# EAGLE design defmon (EAGLE 6.6.0)
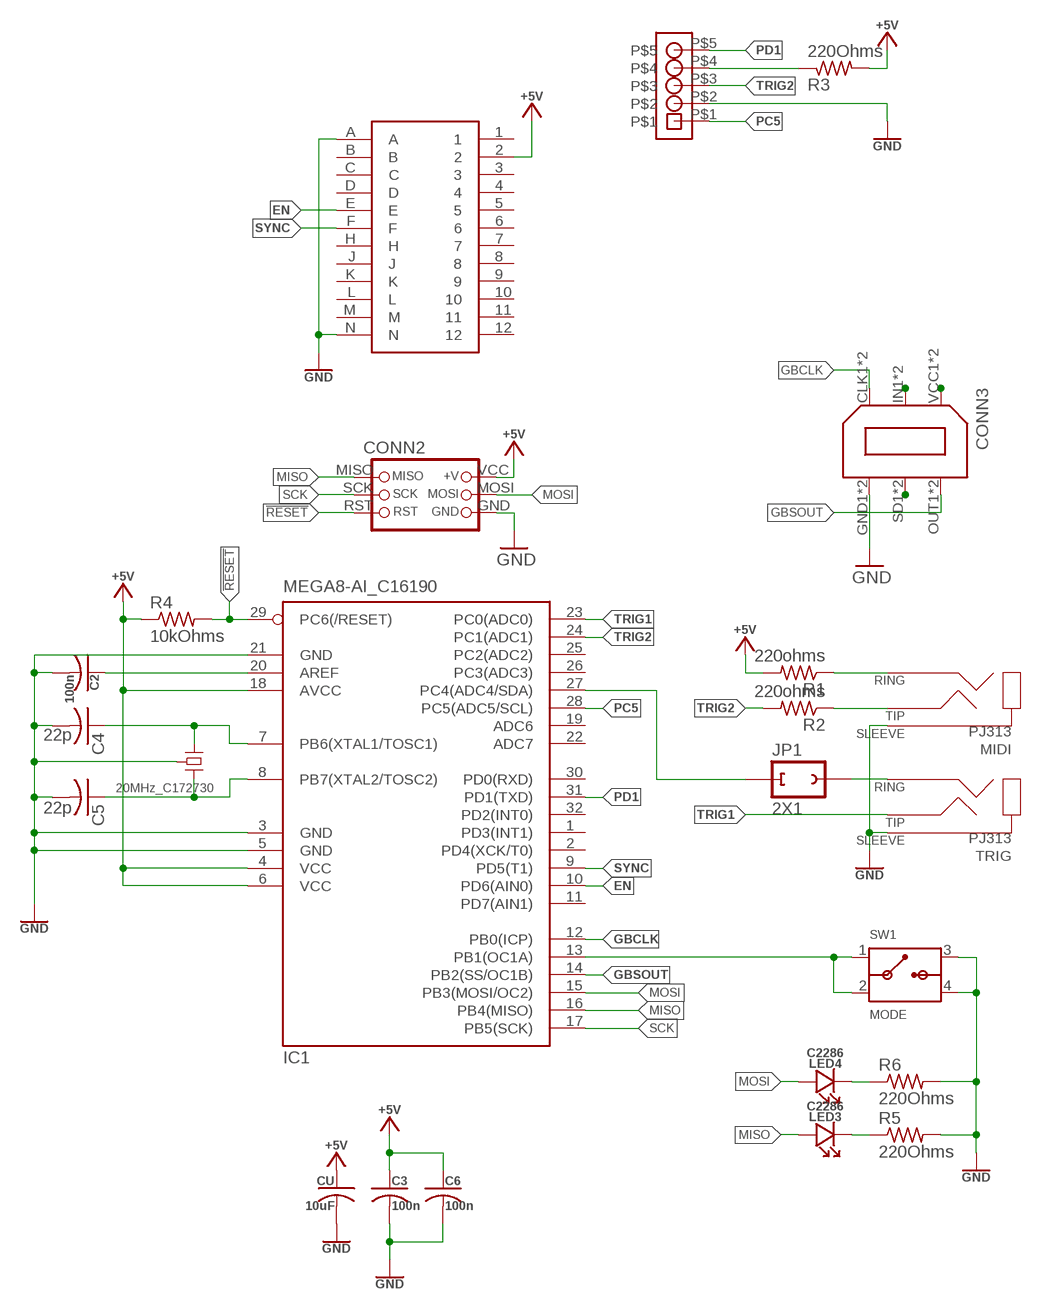
[diagram p0: schematic, sheet 1]

## Parts
C2  100n  C-USC0603K  [C0603K]
C3  100n  C-USC0603K  [C0603K]
C4  22p  C-USC0603K  [C0603K]
C5  22p  C-USC0603K  [C0603K]
C6  100n  C-USC0603K  [C0603K]
CONN2  DNP  ICSP  [ICSP_SMD_PROBE]
CONN3  LINK_PORTFINAL  [DUAL_BAORD_LINK_FINAL]
CU  10uF  C-USC0603K  [C0603K]
DIN  1X5  [1X5]
IC1  MEGA8-AI_C16190  MEGA8-AI  [TQFP32-08]
JP1  2X1  [2X1]
LED3  C2286  0603LED  [0603K]
LED4  C2286  0603LED  [0603K]
MIDI  PJ313  [PJ313D]
Q1  20MHz_C172730  CRYSTAL  [SX3225]
R1  220ohms  R-US_R0603  [R0603]
R2  220ohms  R-US_R0603  [R0603]
R3  220Ohms  R-US_R0603  [R0603]
R4  10kOhms  R-US_R0603  [R0603]
R5  220Ohms  R-US_R0603  [R0603]
R6  220Ohms  R-US_R0603  [R0603]
SW1  MODE  TACTILETS5215A  [TS5215A]
TRIG  PJ313  [PJ313D]
U$2  CONNECTOR_C64UJ  [C64_USERPORT]

## Nets
!RESET: CONN2.RST IC1.29(PC6(/RESET)) R4.2
+5V: C3.1 C6.1 CONN2.VCC(+V) CU.1 IC1.4(VCC) IC1.6(VCC) IC1.18(AVCC) R1.2 R3.2 R4.1 U$2.2
AREF: C2.1 IC1.20(AREF)
EN: IC1.10(PD6(AIN0)) U$2.E
GBCLK: CONN3.CLK1(CLK) CONN3.CLK2(CLK) IC1.12(PB0(ICP))
GBSOUT: CONN3.OUT1(OUT) CONN3.OUT2(OUT) IC1.14(PB2(SS/OC1B))
GND: C2.2 C3.2 C4.2 C5.2 C6.2 CONN2.GND CONN3.GND1(GND) CONN3.GND2(GND) CU.2 DIN.P$2 IC1.3(GND) IC1.5(GND) IC1.21(GND) MIDI.2 MIDI.22 Q1.2(GND) Q1.4(GND) R5.2 R6.2 SW1.3(B1) SW1.4(B2) TRIG.2 TRIG.22 U$2.A U$2.N
MISO: CONN2.MISO IC1.16(PB4(MISO)) LED3.A
MOSI: CONN2.MOSI IC1.15(PB3(MOSI/OC2)) LED4.A
N$1: CONN3.VCC1(+5V) CONN3.VCC2(+5V)
N$2: CONN3.SD1(SD) CONN3.SD2(SD)
N$3: DIN.P$4 R3.1
N$4: LED3.C R5.1
N$5: CONN3.IN1(IN) CONN3.IN2(IN)
N$6: MIDI.4 MIDI.44 R2.1
N$7: LED4.C R6.1
N$8: C4.1 IC1.7(PB6(XTAL1/TOSC1)) Q1.3(X1)
N$9: JP1.P$2 TRIG.3
N$10: IC1.27(PC4(ADC4/SDA)) JP1.P$1
N$11: C5.1 IC1.8(PB7(XTAL2/TOSC2)) Q1.1(X2)
N$12: MIDI.3 R1.1
N$20: IC1.13(PB1(OC1A)) SW1.1(A1) SW1.2(A2)
PC5: DIN.P$1 IC1.28(PC5(ADC5/SCL))
PD1: DIN.P$5 IC1.31(PD1(TXD))
SCK: CONN2.SCK IC1.17(PB5(SCK))
SYNC: IC1.9(PD5(T1)) U$2.F
TRIG1: IC1.23(PC0(ADC0)) TRIG.4 TRIG.44
TRIG2: DIN.P$3 IC1.24(PC1(ADC1)) R2.2
Unconnected: IC1.1(PD3(INT1)) IC1.2(PD4(XCK/T0)) IC1.11(PD7(AIN1)) IC1.19(ADC6) IC1.22(ADC7) IC1.25(PC2(ADC2)) IC1.26(PC3(ADC3)) IC1.30(PD0(RXD)) IC1.32(PD2(INT0)) U$2.1 U$2.3 U$2.4 U$2.5 U$2.6 U$2.7 U$2.8 U$2.9 U$2.10 U$2.11 U$2.12 U$2.B U$2.C U$2.D U$2.H U$2.J U$2.K U$2.L U$2.M

## Library data of the parts
C2-C6 CU = rcl:C-US: CAPACITOR, American symbol
CONN2 = GenMDMv2:ICSP
CONN3 = LinkPort by Jazz:LINK_PORT
DIN = header by Jazz:1X5
IC1 = atmel:MEGA8: MICROCONTROLLER 8 Kbytes FLASH, 1 kbytes SRAM, 512 bytes EEPROM, USART, 6-channel 10 bit ADC, 2-channel 8 bit ADC Pin compatible with Atmega48, ATMega88, ATMega168 Source: avr.lbr; MPN: ATMEGA8-16AU; OC_FARNELL: 9171371; OC_NEWARK: 73M8863
JP1 = header by Jazz:2X1
LED3 LED4 = Led by Jazz:0603LED
MIDI TRIG = GenMDMv200:PJ313
Q1 = GenMDMv200:CRYSTAL: (16MHz) LCSC: C13738
R1-R6 = rcl:R-US_: RESISTOR, American symbol
SW1 = Switch by Jazz:TACTILE
U$2 = defmon:CONNECTOR_C64U

## Board
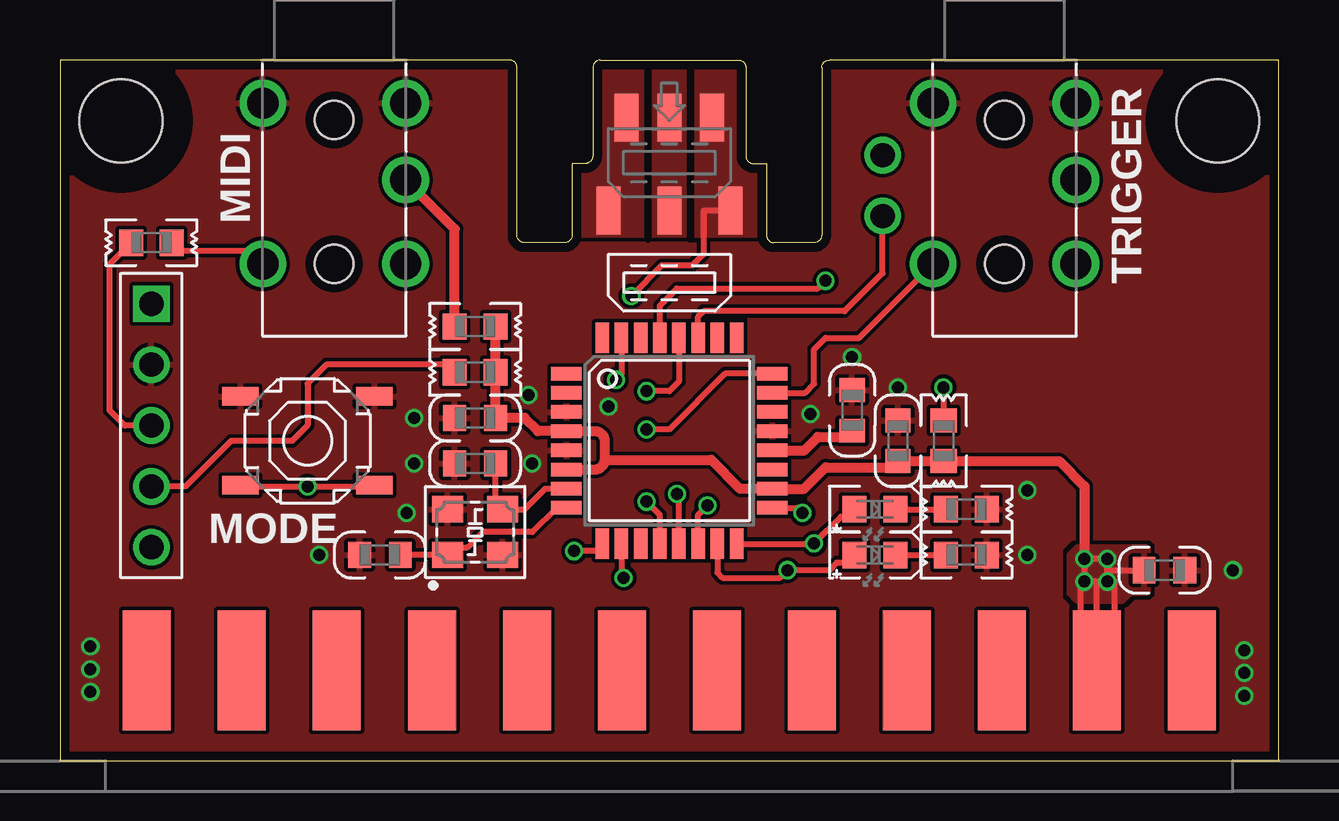
[diagram p1: board, top side]
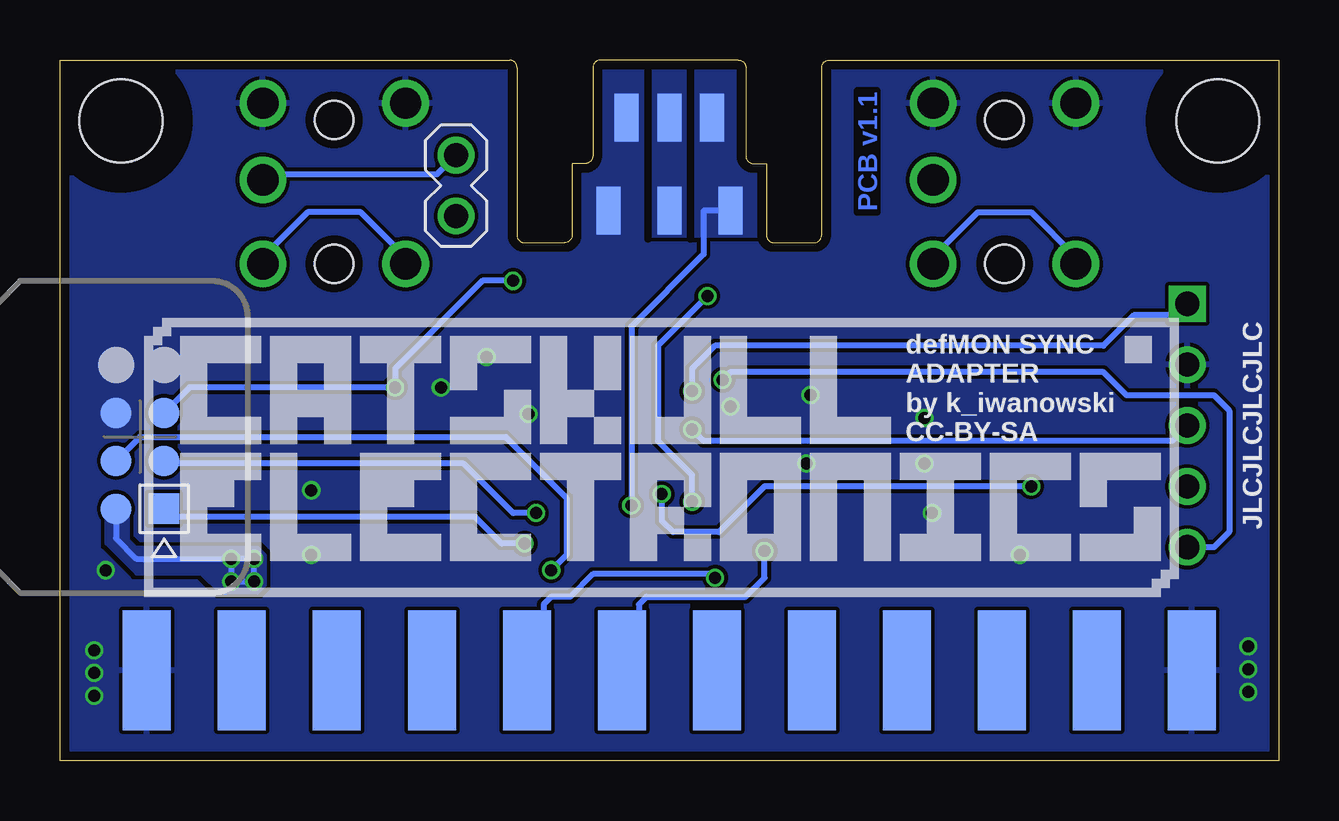
[diagram p2: board, bottom side, seen from below]

Size 50.8 x 29.21 mm. Coordinates in mm from the lower left corner, seen from the top.
Outline: 29.77,21.59 31.43,21.59 arc90 31.75,21.91 31.75,28.89 arc-90 32.07,29.21 50.8,29.21 50.8,0 0,0 0,29.21 18.73,29.21 arc-90 19.05,28.89 19.05,21.91 arc90 19.37,21.59 21.03,21.59
Copper layers (1*16): Top 0.035mm / dielectric 1.5mm / Bottom 0.035mm
Design rules "PCBWAY": minimum track width 4mil, minimum drill 0.2mm, track to track 6mil, track to pad 6mil, pad to pad 6mil, via to via 6mil, smd to smd 6mil, copper to edge 15mil, drill to drill 6mil, minimum pad ring 6mil, minimum via ring 5mil, stop-mask expansion 4mil, vias tented up to drill 37mil, thermal gap 6mil

### Footprints (pad centres in the part's own frame; a part is rotated, then mirrored left to right if it is on the bottom)
C0603K = smd 1 x 1.1: 1 -0.85,0; 2 0.85,0
ICSP_SMD_PROBE = smd 1.27 x 1.27: GND 1,-1; MISO -1,3; MOSI 1,1; RST -1,-1; SCK -1,1; VCC 1,3
DUAL_BAORD_LINK_FINAL = smd 2 x 1: CLK1 -6.287,-2.54; CLK2 -2.413,-1.778; IN1 -6.287,0; IN2 -2.413,0; VCC1 -6.287,2.54; VCC2 -2.413,1.778 | smd 2 x 1 bottom: GND1 -6.287,-2.54; GND2 -2.413,-1.778; OUT1 -6.287,2.54; OUT2 -2.413,1.778; SD1 -6.287,0; SD2 -2.413,0
1X5 = drill 1.016 square: P$1 -5.08,0 | drill 1.016: P$2 -2.54,0; P$3 0,0; P$4 2.54,0; P$5 5.08,0
TQFP32-08 = smd 1.27 x 0.559: 1 -4.293,2.8; 2 -4.293,2; 3 -4.293,1.2; 4 -4.293,0.4; 5 -4.293,-0.4; 6 -4.293,-1.2; 7 -4.293,-2; 8 -4.293,-2.8; 17 4.293,-2.8; 18 4.293,-2; 19 4.293,-1.2; 20 4.293,-0.4; 21 4.293,0.4; 22 4.293,1.2; 23 4.293,2; 24 4.293,2.8 | smd 0.559 x 1.27: 9 -2.8,-4.293; 10 -2,-4.293; 11 -1.2,-4.293; 12 -0.4,-4.293; 13 0.4,-4.293; 14 1.2,-4.293; 15 2,-4.293; 16 2.8,-4.293; 25 2.8,4.293; 26 2,4.293; 27 1.2,4.293; 28 0.4,4.293; 29 -0.4,4.293; 30 -1.2,4.293; 31 -2,4.293; 32 -2.8,4.293
2X1 = drill 1.016: P$1 -1.27,0; P$2 1.27,0
0603K = smd 1 x 1.1: A 0.85,0; C -0.85,0
PJ313D = drill 1.3: 2 -2.975,-1.8; 3 2.975,-5; 4 -2.975,-8.5; 22 2.975,-1.8; 44 2.975,-8.5 | hole 1.6: 0,-2.5; 0,-8.5
SX3225 = smd 1.3 x 1.1: 1 -1.15,-0.95; 2 1.15,-0.95; 3 1.15,0.95; 4 -1.15,0.95
R0603 = smd 1 x 1.1: 1 -0.85,0; 2 0.85,0
TS5215A = smd 1.524 x 0.762: 1 -2.794,1.85; 2 2.794,1.85; 3 -2.794,-1.85; 4 2.794,-1.85
C64_USERPORT = smd 2 x 5: 1 21.78,5.04; 2 17.82,5.04; 3 13.86,5.04; 4 9.9,5.04; 5 5.94,5.04; 6 1.98,5.04; 7 -1.98,5.04; 8 -5.94,5.04; 9 -9.9,5.04; 10 -13.86,5.04; 11 -17.82,5.04; 12 -21.78,5.04 | smd 2 x 5 bottom: A 21.78,5.04; B 17.82,5.04; C 13.86,5.04; D 9.9,5.04; E 5.94,5.04; F 1.98,5.04; H -1.98,5.04; J -5.94,5.04; K -9.9,5.04; L -13.86,5.04; M -17.82,5.04; N -21.78,5.04
MOUNT4-40 = hole 3.45: 0,0

### Placement (x,y rotation side)
C2  33.02,14.61 90 top
C3  34.92,13.34 90 top
C4  17.3,12.38 180 top
C5  13.33,8.57 180 top
C6  17.3,14.29 180 top
CONN2  47.47,13.49 180 bottom
CONN3  25.4,29.21 90 top
CU  46.04,7.94 0 top
DIN  3.81,13.97 270 top
IC1  25.4,13.34 0 top
JP1  34.29,23.97 90 bottom
LED3  33.97,10.48 180 top
LED4  33.97,8.57 180 top
MIDI  11.43,29.21 0 top
Q1  17.3,9.53 0 top
R1  17.3,18.1 0 top
R2  3.81,21.59 180 top
R3  17.3,16.19 0 top
R4  36.83,13.34 90 top
R5  37.78,10.48 0 top
R6  37.78,8.57 0 top
SW1  10.32,13.34 180 top
TRIG  39.37,29.21 0 top
U$1  [JLCJLCJLCJLC]  1.11,13.97 270 bottom
U$2  25.4,-1.27 0 top
U$3  [MOUNT4-40]  2.54,26.67 0 top
U$8  [MOUNT4-40]  48.26,26.67 0 top
U$9  [CATSKULL_PIXEL_MD]  25.72,6.83 0 bottom

### Tracks (layer width: path | path; a pad name or v marks a point on that pad's centre or on a via)
!RESET  (via drill 0.5)
  Top 0.254: IC1.29 25,18.97 25.72,19.68 31.59,19.68 v31.91,20 | v36.83,15.56 R4.2
  Bottom 0.254: CONN2.RST 45.4,15.56 v36.83,15.56 36.83,16.35 33.18,20 v31.91,20
+5V  (via drill 0.5)
  Top 0.254: v43.66,7.46 v43.66,8.41 | v43.66,8.41 v42.7,8.41 v42.7,7.46 | v43.66,8.41 43.66,7.94 CU.1 | 43.18,7.46 v42.7,7.46 | U$2.2 42.55,3.77 42.55,7.46 v42.7,7.46 | U$2.2 43.97,3.77 43.97,7.46 v43.66,7.46 | U$2.2 43.22,7.46 v43.66,7.46
  Top 0.406: v42.7,8.41 42.7,11.43 41.65,12.49 R4.1 C3.1 34.66,12.22 31.91,12.22 31.02,11.34 IC1.18 28.35,11.34 27.15,12.54 22.7,12.54 | 22.7,12.54 22.7,13.34 arc90 22.3,13.74 IC1.4 19.92,13.74 19.37,14.29 C6.1 R3.2 R1.2 | IC1.6 22.29,12.13 arc90 22.7,12.54
  Bottom 0.254: CONN2.VCC 48.47,9.27 47.61,8.41 v43.66,8.41 | v43.66,8.41 v43.66,7.46 v42.7,7.46 v42.7,8.41 v43.66,8.41
  pour Top: 42.39,6.67 44.29,6.67 44.61,6.99 45.24,6.99 45.4,7.14 45.4,8.73 45.24,8.89 42.39,8.89 42.07,8.57 42.07,6.99
  pour Bottom: 42.23,8.57 42.55,8.89 47.62,8.89 47.94,9.21 47.94,10.64 48.1,10.79 48.74,10.79 48.89,10.64 48.89,9.05 47.62,7.78 44.93,7.78 44.13,6.99 42.55,6.99 42.23,7.3
AREF
  Top 0.406: IC1.20 31.03,12.94 31.59,13.49 32.76,13.49 C2.1
EN  (via drill 0.5)
  Top 0.254: IC1.10 23.4,7.71 v23.49,7.62
  Bottom 0.254: U$2.E 30.64,4.51 30.64,6.51 30.32,6.83 29.53,6.83 28.57,7.78 23.65,7.78 v23.49,7.62
GBCLK  (via drill 0.5)
  Top 0.254: IC1.12 25,10.24 v24.45,10.79 | CONN3.CLK1 26.83,22.92 26.83,21.11 26.35,20.64 25.08,20.64 v23.81,19.37
  Bottom 0.254: v24.45,10.79 24.45,11.91 25.88,13.34 25.88,17.3 v23.81,19.37
  pour Top: 29.53,21.91 26.43,21.91 26.43,29.21 29.53,29.21
GBSOUT  (via drill 0.5)
  Top 0.254: IC1.14 26.6,10.25 v26.99,10.64
  Bottom 0.254: CONN3.OUT1 23.97,22.92 23.97,21.11 26.99,18.1 v26.99,10.64
  pour Bottom: 21.27,21.91 24.37,21.91 24.37,29.21 21.27,29.21
GND  (via drill 0.5)
  other vias: 31.27,14.45 40.32,11.27 40.32,8.57 19.68,12.38 19.53,15.24 22.86,14.76 14.76,14.29 10.79,8.57 14.45,10.32 14.76,12.38 34.92,15.56 33.02,16.83 48.89,7.94 49.37,3.65 49.37,4.6 49.37,2.7 1.27,3.81 1.27,4.76 1.27,2.86
  pour Top (rank 3): 0,0 50.8,0 50.8,29.21 0,29.21
  pour Bottom (rank 3): 0,0 50.8,0 50.8,29.21 0,29.21
MISO  (via drill 0.5)
  Top 0.254: IC1.16 31.27,9.04 v31.43,9.05 32.54,10.16 32.8,10.16 LED3.A
  Bottom 0.254: CONN2.MISO 46.13,10.16 33.5,10.16 32.38,9.05 v31.43,9.05
MOSI  (via drill 0.5)
  Top 0.254: IC1.15 27.4,7.84 27.62,7.62 30,7.62 v30.32,7.94 32.07,7.94 32.38,8.26 32.8,8.26 LED4.A
  Bottom 0.254: CONN2.MOSI 47.47,13.49 32.23,13.49 29.69,10.95 29.69,8.57 v30.32,7.94
N$1
  pour Top: 24.37,21.91 24.37,29.21 21.27,29.21 21.27,21.91
N$2
  pour Bottom (rank 2): 26.11,29.21 26.11,21.91 24.69,21.91 24.69,29.21
N$3
  Top 0.254: DIN.P$4 5.24,11.43 7.14,13.34 9.68,13.34 10.32,13.97 10.32,15.72 11.11,16.51 16.14,16.51 R3.1
N$4
  Top 0.254: LED3.C R5.1
N$5
  pour Top (rank 2): 26.11,21.91 24.69,21.91 24.69,29.21 26.11,29.21
N$6
  Top 0.254: R2.1 4.98,21.27 7.89,21.27 MIDI.4
  Bottom 0.254: MIDI.4 8.45,21 10.32,22.86 12.54,22.86 14.4,21 MIDI.44
N$7
  Top 0.254: LED4.C R6.1
N$8
  Top 0.254: C4.1 18.15,10.78 Q1.3 19.36,10.47 20.22,11.34 IC1.7
N$9
  Bottom 0.254: TRIG.3 42.11,24.45 35.08,24.45 JP1.P$2
N$10
  Top 0.254: IC1.27 26.6,18.5 26.83,18.73 32.7,18.73 34.29,20.32 JP1.P$1
N$11
  Top 0.254: IC1.8 20.7,10.54 19.68,9.53 17.62,9.53 16.99,8.89 16.47,8.89 Q1.1 C5.1
N$12
  Top 0.406: R1.1 16.45,22.16 MIDI.3
N$20  (via drill 0.5)
  Top 0.254: IC1.13 25.8,11.03 v25.72,11.11 | SW1.2 7.58,11.43 v10.32,11.43 13.06,11.43 SW1.1
  Bottom 0.254: v25.72,11.11 25.72,10 25.24,9.53 23.34,9.53 21.43,11.43 v10.32,11.43
PC5  (via drill 0.5)
  Top 0.254: IC1.28 25.8,15.8 25.4,15.4 v24.45,15.4
  Bottom 0.254: DIN.P$1 4.29,18.57 6.03,18.57 7.3,17.3 23.49,17.3 24.45,16.35 v24.45,15.4
PD1  (via drill 0.5)
  Top 0.254: IC1.31 23.4,16.1 v23.18,15.88
  Bottom 0.254: DIN.P$5 2.7,8.89 2.06,9.53 2.06,14.61 2.7,15.24 6.35,15.24 7.3,16.19 22.86,16.19 v23.18,15.88
SCK  (via drill 0.5)
  Top 0.254: IC1.17 30.74,10.54 v30.96,10.32
  Bottom 0.254: v30.96,10.32 31.91,10.32 33.97,12.38 46.35,12.38 CONN2.SCK
SYNC  (via drill 0.5)
  Top 0.254: v21.43,8.73 22.6,8.73 IC1.9
  Bottom 0.254: v21.43,8.73 21.43,7.62 22.22,6.83 26.35,6.83 26.67,6.51 26.67,4.52 U$2.F
TRIG1
  Top 0.254: IC1.23 31.05,15.34 31.43,15.72 31.43,17.14 31.91,17.62 33.31,17.62 TRIG.4
  Bottom 0.254: TRIG.44 42.34,21 40.48,22.86 38.26,22.86 36.39,21 TRIG.4
TRIG2  (via drill 0.5)
  Top 0.254: IC1.24 27.72,16.14 25.4,13.81 v24.45,13.81 | DIN.P$3 2.7,13.97 2.06,14.61 2.06,20.69 R2.2
  Bottom 0.254: DIN.P$3 4.45,13.34 23.97,13.34 v24.45,13.81

### Text on the board
Bottom: PCB v1.1
tPlace: MIDI | TRIGGER | MODE
bPlace: defMON SYNC / ADAPTER / by k_iwanowski / CC-BY-SA